# EAGLE design pccasefanctrlx8 (EAGLE 6.0)
DESIGN_REV: 1.0; DRAWING_NAME: PCBCaseFanCTRx8
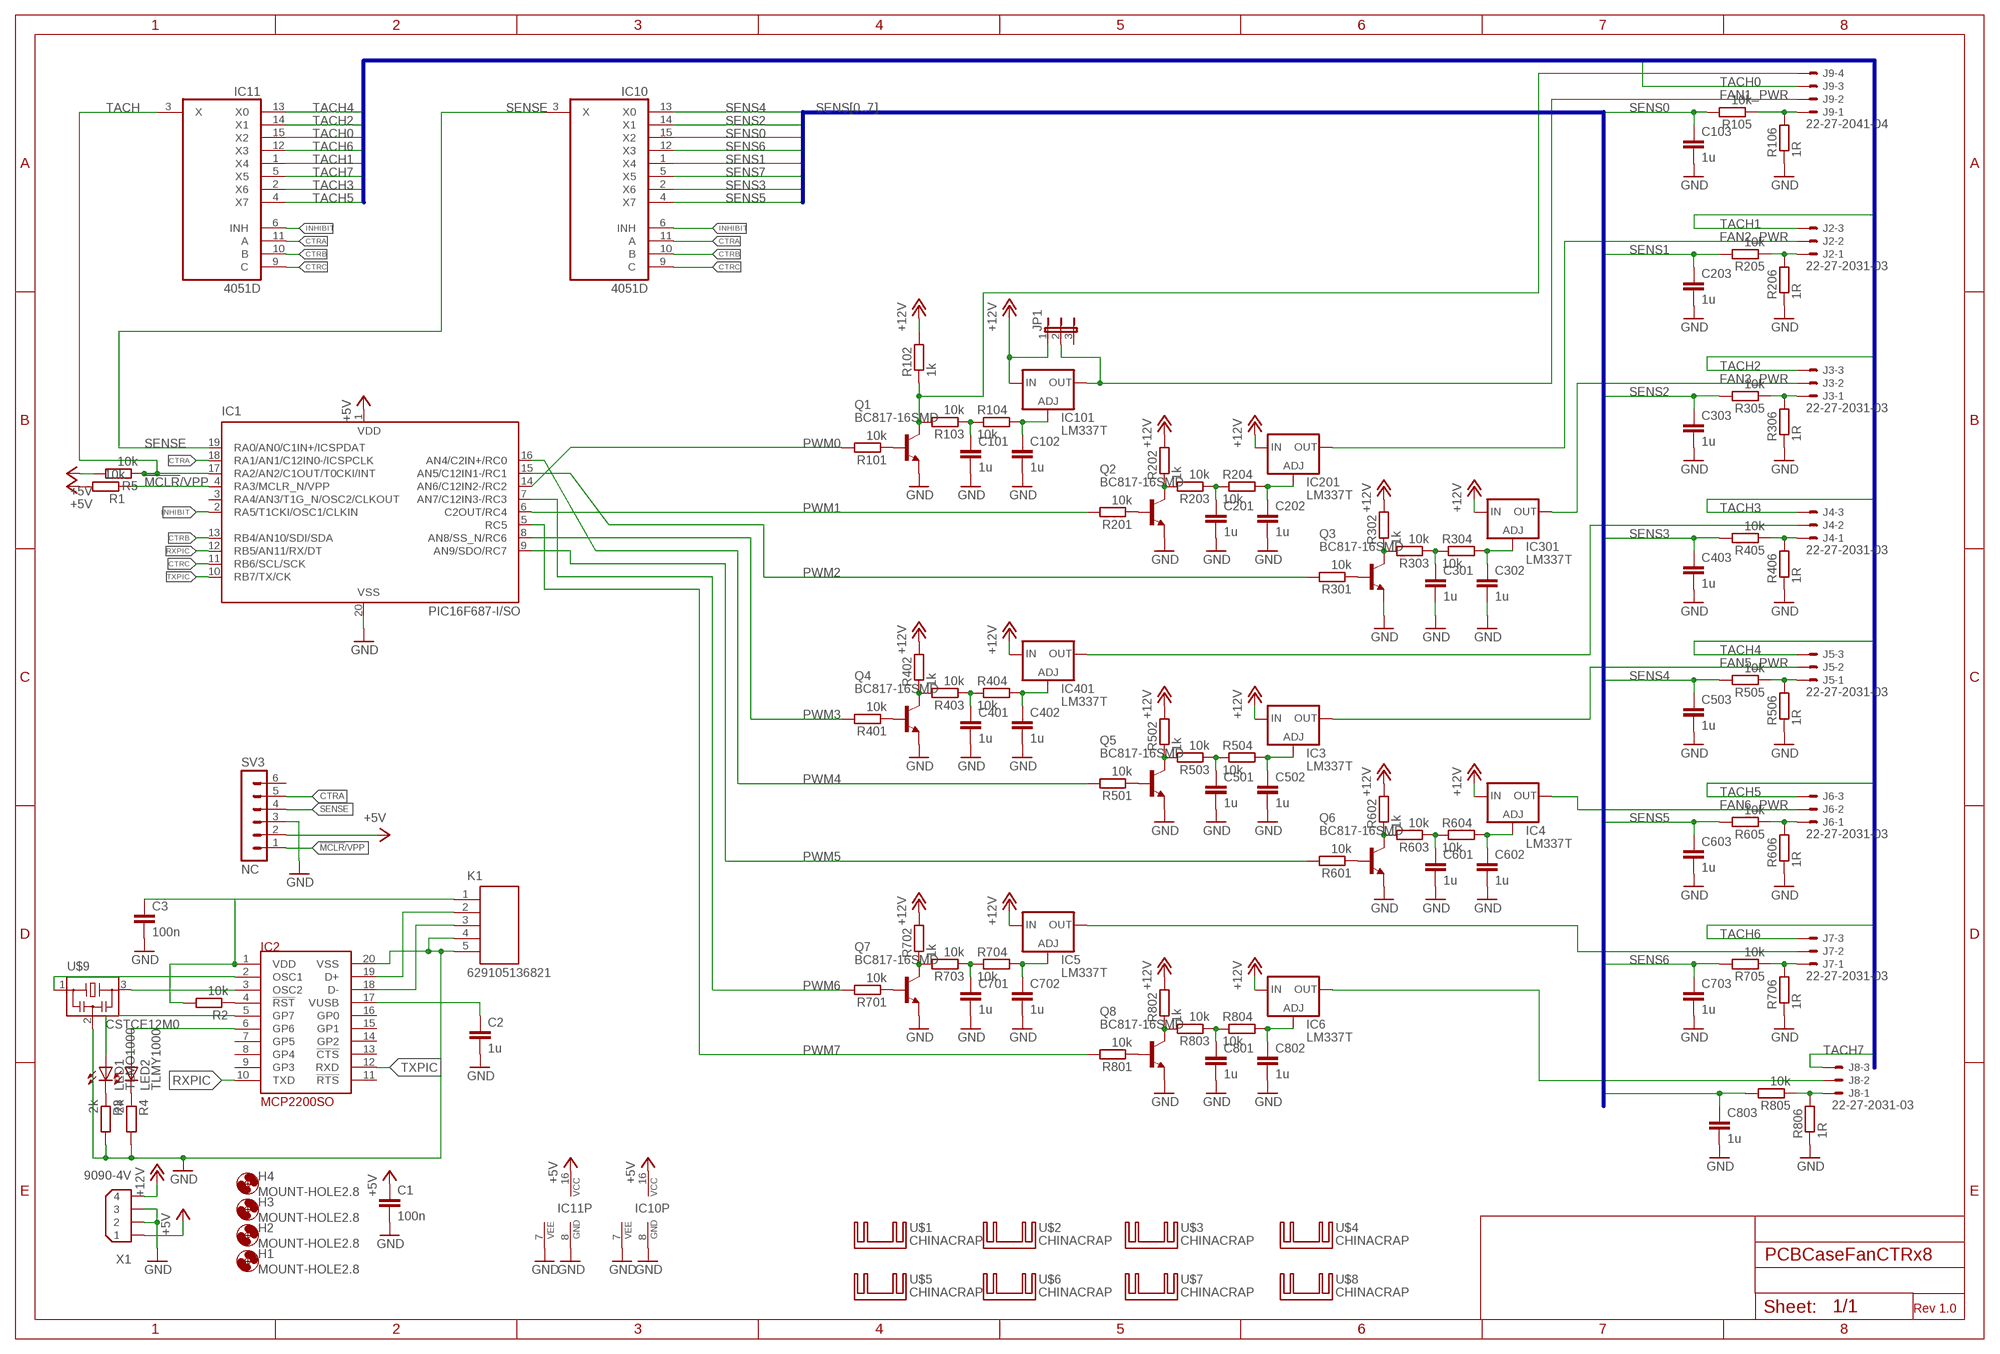
[diagram p0: schematic, sheet 1]

## Parts
C1  100n  C-EUC0603K  [C0603K]
C2  1u  C-EUC0603K  [C0603K]
C3  100n  C-EUC0603K  [C0603K]
C101  1u  C-EUC0603K  [C0603K]
C102  1u  C-EUC0603K  [C0603K]
C103  1u  C-EUC0603K  [C0603K]
C201  1u  C-EUC0603K  [C0603K]
C202  1u  C-EUC0603K  [C0603K]
C203  1u  C-EUC0603K  [C0603K]
C301  1u  C-EUC0603K  [C0603K]
C302  1u  C-EUC0603K  [C0603K]
C303  1u  C-EUC0603K  [C0603K]
C401  1u  C-EUC0603K  [C0603K]
C402  1u  C-EUC0603K  [C0603K]
C403  1u  C-EUC0603K  [C0603K]
C501  1u  C-EUC0603K  [C0603K]
C502  1u  C-EUC0603K  [C0603K]
C503  1u  C-EUC0603K  [C0603K]
C601  1u  C-EUC0603K  [C0603K]
C602  1u  C-EUC0603K  [C0603K]
C603  1u  C-EUC0603K  [C0603K]
C701  1u  C-EUC0603K  [C0603K]
C702  1u  C-EUC0603K  [C0603K]
C703  1u  C-EUC0603K  [C0603K]
C801  1u  C-EUC0603K  [C0603K]
C802  1u  C-EUC0603K  [C0603K]
C803  1u  C-EUC0603K  [C0603K]
H1  MOUNT-HOLE2.8  [2,8]
H2  MOUNT-HOLE2.8  [2,8]
H3  MOUNT-HOLE2.8  [2,8]
H4  MOUNT-HOLE2.8  [2,8]
IC1  PIC16F687-I/SO  [SO-20W]
IC2  MCP2200SO  [SO-20W]
IC3  LM337T  LM317TS  [317TS]
IC4  LM337T  LM317TS  [317TS]
IC5  LM337T  LM317TS  [317TS]
IC6  LM337T  LM317TS  [317TS]
IC10  4051D  [SO16]
IC11  4051D  [SO16]
IC101  LM337T  LM317TS  [317TS]
IC201  LM337T  LM317TS  [317TS]
IC301  LM337T  LM317TS  [317TS]
IC401  LM337T  LM317TS  [317TS]
J2  22-27-2031-03  [6410-03]
J3  22-27-2031-03  [6410-03]
J4  22-27-2031-03  [6410-03]
J5  22-27-2031-03  [6410-03]
J6  22-27-2031-03  [6410-03]
J7  22-27-2031-03  [6410-03]
J8  22-27-2031-03  [6410-03]
J9  22-27-2041-04  [6410-04]
JP1  JP2E  [JP2]
K1  629105136821  [629105136821]
LED1  TLMO1000  LEDSML0603  [SML0603]
LED2  TLMY1000  LEDSML0603  [SML0603]
Q1  BC817-16SMD  [SOT23-BEC]
Q2  BC817-16SMD  [SOT23-BEC]
Q3  BC817-16SMD  [SOT23-BEC]
Q4  BC817-16SMD  [SOT23-BEC]
Q5  BC817-16SMD  [SOT23-BEC]
Q6  BC817-16SMD  [SOT23-BEC]
Q7  BC817-16SMD  [SOT23-BEC]
Q8  BC817-16SMD  [SOT23-BEC]
R1  10k  R-EU_R0603  [R0603]
R2  10k  R-EU_R0603  [R0603]
R3  2k  R-EU_R0603  [R0603]
R4  2k  R-EU_R0603  [R0603]
R5  10k  R-EU_R0603  [R0603]
R101  10k  R-EU_R0603  [R0603]
R102  1k  R-EU_R0603  [R0603]
R103  10k  R-EU_R0603  [R0603]
R104  10k  R-EU_R0603  [R0603]
R105  10k  R-EU_R0603  [R0603]
R106  1R  R-EU_0613/5V  [P0613V]
R201  10k  R-EU_R0603  [R0603]
R202  1k  R-EU_R0603  [R0603]
R203  10k  R-EU_R0603  [R0603]
R204  10k  R-EU_R0603  [R0603]
R205  10k  R-EU_R0603  [R0603]
R206  1R  R-EU_0613/5V  [P0613V]
R301  10k  R-EU_R0603  [R0603]
R302  1k  R-EU_R0603  [R0603]
R303  10k  R-EU_R0603  [R0603]
R304  10k  R-EU_R0603  [R0603]
R305  10k  R-EU_R0603  [R0603]
R306  1R  R-EU_0613/5V  [P0613V]
R401  10k  R-EU_R0603  [R0603]
R402  1k  R-EU_R0603  [R0603]
R403  10k  R-EU_R0603  [R0603]
R404  10k  R-EU_R0603  [R0603]
R405  10k  R-EU_R0603  [R0603]
R406  1R  R-EU_0613/5V  [P0613V]
R501  10k  R-EU_R0603  [R0603]
R502  1k  R-EU_R0603  [R0603]
R503  10k  R-EU_R0603  [R0603]
R504  10k  R-EU_R0603  [R0603]
R505  10k  R-EU_R0603  [R0603]
R506  1R  R-EU_0613/5V  [P0613V]
R601  10k  R-EU_R0603  [R0603]
R602  1k  R-EU_R0603  [R0603]
R603  10k  R-EU_R0603  [R0603]
R604  10k  R-EU_R0603  [R0603]
R605  10k  R-EU_R0603  [R0603]
R606  1R  R-EU_0613/5V  [P0613V]
R701  10k  R-EU_R0603  [R0603]
R702  1k  R-EU_R0603  [R0603]
R703  10k  R-EU_R0603  [R0603]
R704  10k  R-EU_R0603  [R0603]
R705  10k  R-EU_R0603  [R0603]
R706  1R  R-EU_0613/5V  [P0613V]
R801  10k  R-EU_R0603  [R0603]
R802  1k  R-EU_R0603  [R0603]
R803  10k  R-EU_R0603  [R0603]
R804  10k  R-EU_R0603  [R0603]
R805  10k  R-EU_R0603  [R0603]
R806  1R  R-EU_0613/5V  [P0613V]
SV3  NC  MA06-1  [MA06-1]
U$1  CHINACRAP  [MYCHINACRAP]
U$2  CHINACRAP  [MYCHINACRAP]
U$3  CHINACRAP  [MYCHINACRAP]
U$4  CHINACRAP  [MYCHINACRAP]
U$5  CHINACRAP  [MYCHINACRAP]
U$6  CHINACRAP  [MYCHINACRAP]
U$7  CHINACRAP  [MYCHINACRAP]
U$8  CHINACRAP  [MYCHINACRAP]
U$9  CSTCE12M0  [CSTCE_G]
X1  9090-4V  [9090-4V]

## Nets
!MCLR!/VPP: IC1.4(RA3/MCLR_N/VPP) R1.1 SV3.1
+5V: C1.1 IC1.1(VDD) IC10.16(VCC) IC11.16(VCC) R1.2 R5.2 SV3.2 X1.1
+12V: IC3.3(IN) IC4.3(IN) IC5.3(IN) IC6.3(IN) IC101.3(IN) IC201.3(IN) IC301.3(IN) IC401.3(IN) JP1.1 R102.2 R202.2 R302.2 R402.2 R502.2 R602.2 R702.2 R802.2 X1.4
CTRA: IC1.18(RA1/AN1/C12IN0-/ICSPCLK) IC10.11(A) IC11.11(A) SV3.5
CTRB: IC1.13(RB4/AN10/SDI/SDA) IC10.10(B) IC11.10(B)
CTRC: IC1.11(RB6/SCL/SCK) IC10.9(C) IC11.9(C)
FAN1_PWR: IC101.2(OUT) J9.2 JP1.2
FAN2_PWR: IC201.2(OUT) J2.2
FAN3_PWR: IC301.2(OUT) J3.2
FAN5_PWR: IC3.2(OUT) J5.2
FAN6_PWR: IC4.2(OUT) J6.2
GND: C1.2 C2.2 C3.2 C101.2 C102.2 C103.2 C201.2 C202.2 C203.2 C301.2 C302.2 C303.2 C401.2 C402.2 C403.2 C501.2 C502.2 C503.2 C601.2 C602.2 C603.2 C701.2 C702.2 C703.2 C801.2 C802.2 C803.2 IC1.20(VSS) IC2.20(VSS) IC10.7(VEE) IC10.8(GND) IC11.7(VEE) IC11.8(GND) K1.4 K1.5 Q1.E Q2.E Q3.E Q4.E Q5.E Q6.E Q7.E Q8.E R3.2 R4.2 R106.1 R206.1 R306.1 R406.1 R506.1 R606.1 R706.1 R806.1 SV3.3 U$9.2 X1.2 X1.3
INHIBIT: IC1.2(RA5/T1CKI/OSC1/CLKIN) IC10.6(INH) IC11.6(INH)
N$1: J9.4 Q1.C R102.1 R103.2
N$2: Q1.B R101.1
N$3: C201.1 R203.1 R204.1
N$4: C101.1 R103.1 R104.1
N$5: C102.1 IC101.1(ADJ) R104.2
N$6: C202.1 IC201.1(ADJ) R204.2
N$7: Q2.C R202.1 R203.2
N$8: Q2.B R201.1
N$9: J9.1 R105.1 R106.2
N$10: J4.1 R405.1 R406.2
N$11: C301.1 R303.1 R304.1
N$12: C302.1 IC301.1(ADJ) R304.2
N$13: Q3.C R302.1 R303.2
N$14: Q3.B R301.1
N$15: C401.1 R403.1 R404.1
N$16: C402.1 IC401.1(ADJ) R404.2
N$17: Q4.C R402.1 R403.2
N$18: Q4.B R401.1
N$19: IC401.2(OUT) J4.2
N$20: J2.1 R205.1 R206.2
N$21: IC2.2(OSC1) U$9.1
N$22: IC2.3(OSC2) U$9.3
N$23: C3.1 IC2.1(VDD) K1.1 R2.2
N$25: IC2.4(!RST!) R2.1
N$26: IC2.18(D-) K1.3
N$27: IC2.19(D+) K1.2
N$28: IC2.5(GP7) LED1.A
N$29: C2.1 IC2.17(VUSB)
N$30: IC2.6(GP6) LED2.A
N$31: LED1.C R3.1
N$32: LED2.C R4.1
N$33: C501.1 R503.1 R504.1
N$34: C502.1 IC3.1(ADJ) R504.2
N$35: Q5.C R502.1 R503.2
N$36: Q5.B R501.1
N$37: C601.1 R603.1 R604.1
N$38: C602.1 IC4.1(ADJ) R604.2
N$39: Q6.C R602.1 R603.2
N$40: Q6.B R601.1
N$41: IC5.2(OUT) J7.2
N$42: C701.1 R703.1 R704.1
N$43: C702.1 IC5.1(ADJ) R704.2
N$44: Q7.C R702.1 R703.2
N$45: Q7.B R701.1
N$46: C801.1 R803.1 R804.1
N$47: C802.1 IC6.1(ADJ) R804.2
N$48: Q8.C R802.1 R803.2
N$49: Q8.B R801.1
N$50: IC6.2(OUT) J8.2
N$51: J3.1 R305.1 R306.2
N$52: J6.1 R605.1 R606.2
N$53: J7.1 R705.1 R706.2
N$54: J8.1 R805.1 R806.2
N$55: J5.1 R505.1 R506.2
PWM0: IC1.14(AN6/C12IN2-/RC2) R101.2
PWM1: IC1.6(C2OUT/RC4) R201.2
PWM2: IC1.15(AN5/C12IN1-/RC1) R301.2
PWM3: IC1.8(AN8/SS_N/RC6) R401.2
PWM4: IC1.16(AN4/C2IN+/RC0) R501.2
PWM5: IC1.9(AN9/SDO/RC7) R601.2
PWM6: IC1.7(AN7/C12IN3-/RC3) R701.2
PWM7: IC1.5(RC5) R801.2
RXPIC: IC1.12(RB5/AN11/RX/DT) IC2.10(TXD)
SENS0: C103.1 IC10.15(X2) R105.2
SENS1: C203.1 IC10.1(X4) R205.2
SENS2: C303.1 IC10.14(X1) R305.2
SENS3: C403.1 IC10.2(X6) R405.2
SENS4: C503.1 IC10.13(X0) R505.2
SENS5: C603.1 IC10.4(X7) R605.2
SENS6: C703.1 IC10.12(X3) R705.2
SENS7: C803.1 IC10.5(X5) R805.2
SENSE: IC1.19(RA0/AN0/C1IN+/ICSPDAT) IC10.3(X) SV3.4
TACH: IC1.17(RA2/AN2/C1OUT/T0CKI/INT) IC11.3(X) R5.1
TACH0: IC11.15(X2) J9.3
TACH1: IC11.1(X4) J2.3
TACH2: IC11.14(X1) J3.3
TACH3: IC11.2(X6) J4.3
TACH4: IC11.13(X0) J5.3
TACH5: IC11.4(X7) J6.3
TACH6: IC11.12(X3) J7.3
TACH7: IC11.5(X5) J8.3
TXPIC: IC1.10(RB7/TX/CK) IC2.12(RXD)
Unconnected: IC1.3(RA4/AN3/T1G_N/OSC2/CLKOUT) IC2.7(GP5) IC2.8(GP4) IC2.9(GP3) IC2.11(!RTS!) IC2.13(!CTS!) IC2.14(GP2) IC2.15(GP1) IC2.16(GP0) JP1.3 SV3.6

## Buses
TACH[0..7]
SENS[0..7]

## Notes on the sheet
- Rev

## Library data of the parts
C1-C3 C101-C103 C201-C203 C301-C303 C401-C403 C501-C503 C601-C603 C701-C703 C801-C803 = rcl:C-EU: CAPACITOR, European symbol
H1-H4 = holes:MOUNT-HOLE: MOUNTING HOLE with drill center marker
IC1 = microchip:PIC16F687
IC2 = microchip:MCP2200
IC3-IC6 IC101 IC201 IC301 IC401 = v-reg:LM317TS: VOLTAGE REGULATOR
IC10 IC11 = 40xx:4051: 8-channel ANALOG MULTIPLEXER
J2-J8 = con-molex:22-?-03: CONNECTOR wire to board 2.54 mm (.1 inch) pitch header; OC_FARNELL: unknown; OC_NEWARK: unknown
J9 = con-molex:22-?-04: CONNECTOR wire to board 2.54 mm (.1 inch) pitch header; OC_FARNELL: unknown; OC_NEWARK: unknown
JP1 = jumper:JP2E: JUMPER
K1 = USBSteckverbinderWR-COM:629105136821: WR-COM SMT Horizontal 5 Contacts Micro USB Type B,5 pins=>Code : Con_I-O_COM_MicroUSB_629105136821 <http://katalog.we-online.de/media/images/eican/Con_I-O_COM_MicroUSB_629105136821_pf2.jpg> Details see: http://katalog.we-online.de/en/em/629_105_136_821 Created 2014-07-09, Karrer Zheng 2014 (C) Würth Elektronik
LED1 LED2 = led:LED: LED OSRAM: - CHIPLED LG R971, LG N971, LY N971, LG Q971, LY Q971, LO R971, LY R971 LH N974, LH R974 LS Q976, LO Q976, LY Q976 LO Q996 - Hyper CHIPLED LW Q18S LB Q993, LB Q99A, LB R99A - SideLED LS A670, LO A670, LY A670, LG A670, LP A670 LB A673, LV A673, LT A673, LW A673 LH A674 LY A675 LS A676, LA A676, LO A676, LY A676, LW A676 LS A679, LY A679, LG A679 - Hyper Micro SIDELED® LS Y876, LA Y876, LO Y876, LY Y876 LT Y87S - SmartLED LW L88C, LW L88S LB L89C, LB L89S, LG L890 LS L89K, LO L89K, LY L89K LS L896, LA L896, LO L896, LY L896 - TOPLED LS T670, LO T670, LY T670, LG T670, LP T670 LSG T670, LSP T670, LSY T670, LOP T670, LYG T670 LG T671, LOG T671, LSG T671 LB T673, LV T673, LT T673, LW T673 LH T674 LS T676, LA T676, LO T676, LY T676, LB T676, LH T676, LSB T676, LW T676 LB T67C, LV T67C, LT T67C, LS T67K, LO T67K, LY T67K, LW E67C LS E67B, LA E67B, LO E67B, LY E67B, LB E67C, LV E67C, LT E67C LW T67C LS T679, LY T679, LG T679 LS T770, LO T770, LY T770, LG T770, LP T770 LB T773, LV T773, LT T773, LW T773 LH T774 LS E675, LA E675, LY E675, LS T675 LS T776, LA T776, LO T776, LY T776, LB T776 LHGB T686 LT T68C, LB T68C - Hyper Mini TOPLED® LB M676 - Mini TOPLED Santana® LG M470 LS M47K, LO M47K, LY M47K Source: http://www.osram.convergy.de LUXEON: - LUMILED® LXK2-PW12-R00, LXK2-PW12-S00, LXK2-PW14-U00, LXK2-PW14-V00 LXK2-PM12-R00, LXK2-PM12-S00, LXK2-PM14-U00 LXK2-PE12-Q00, LXK2-PE12-R00, LXK2-PE12-S00, LXK2-PE14-T00, LXK2-PE14-U00 LXK2-PB12-K00, LXK2-PB12-L00, LXK2-PB12-M00, LXK2-PB14-N00, LXK2-PB14-P00, LXK2-PB14-Q00 LXK2-PR12-L00, LXK2-PR12-M00, LXK2-PR14-Q00, LXK2-PR14-R00 LXK2-PD12-Q00, LXK2-PD12-R00, LXK2-PD12-S00 LXK2-PH12-R00, LXK2-PH12-S00 LXK2-PL12-P00, LXK2-PL12-Q00, LXK2-PL12-R00 Source: www.luxeon.com KINGBRIGHT: KA-3528ASYC Source: www.kingbright.com
Q1-Q8 = transistor-npn:BC817*: NPN Transistor
R1-R5 R101-R106 R201-R206 R301-R306 R401-R406 R501-R506 R601-R606 R701-R706 R801-R806 = resistor:R-EU_: RESISTOR, European symbol
SV3 = con-lstb:MA06-1: PIN HEADER; OC_FARNELL: unknown; OC_NEWARK: unknown
U$1-U$8 = heatsink:CHINACRAP
U$9 = murata-filter:CSTCE12M0
X1 = con-thomas-betts:9090-4: Disk Drive Power four position Source: Thomas & Betts Electronic Interconnects Eiropean Edition 1998; OC_FARNELL: unknown; OC_NEWARK: unknown

## Board
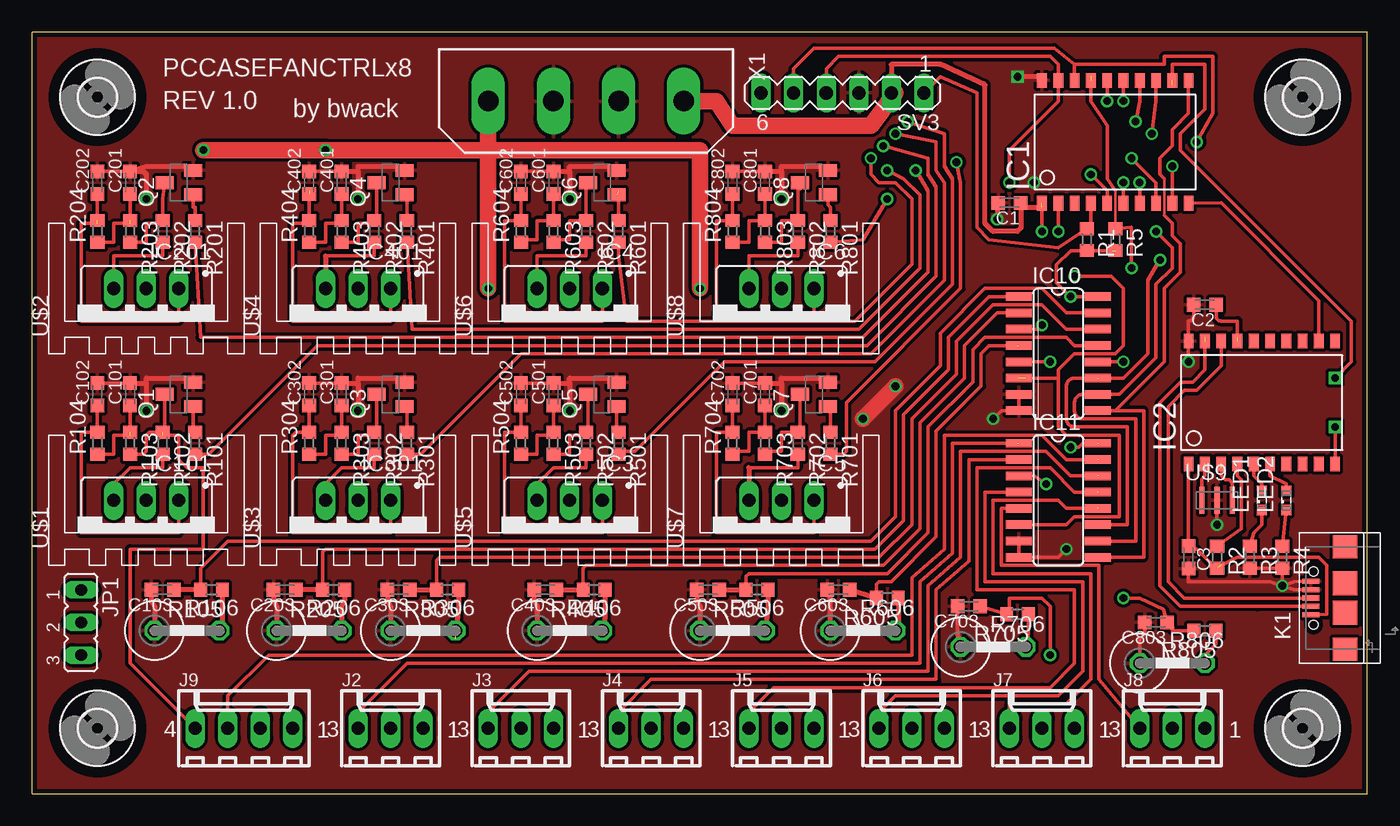
[diagram p1: board, top side]
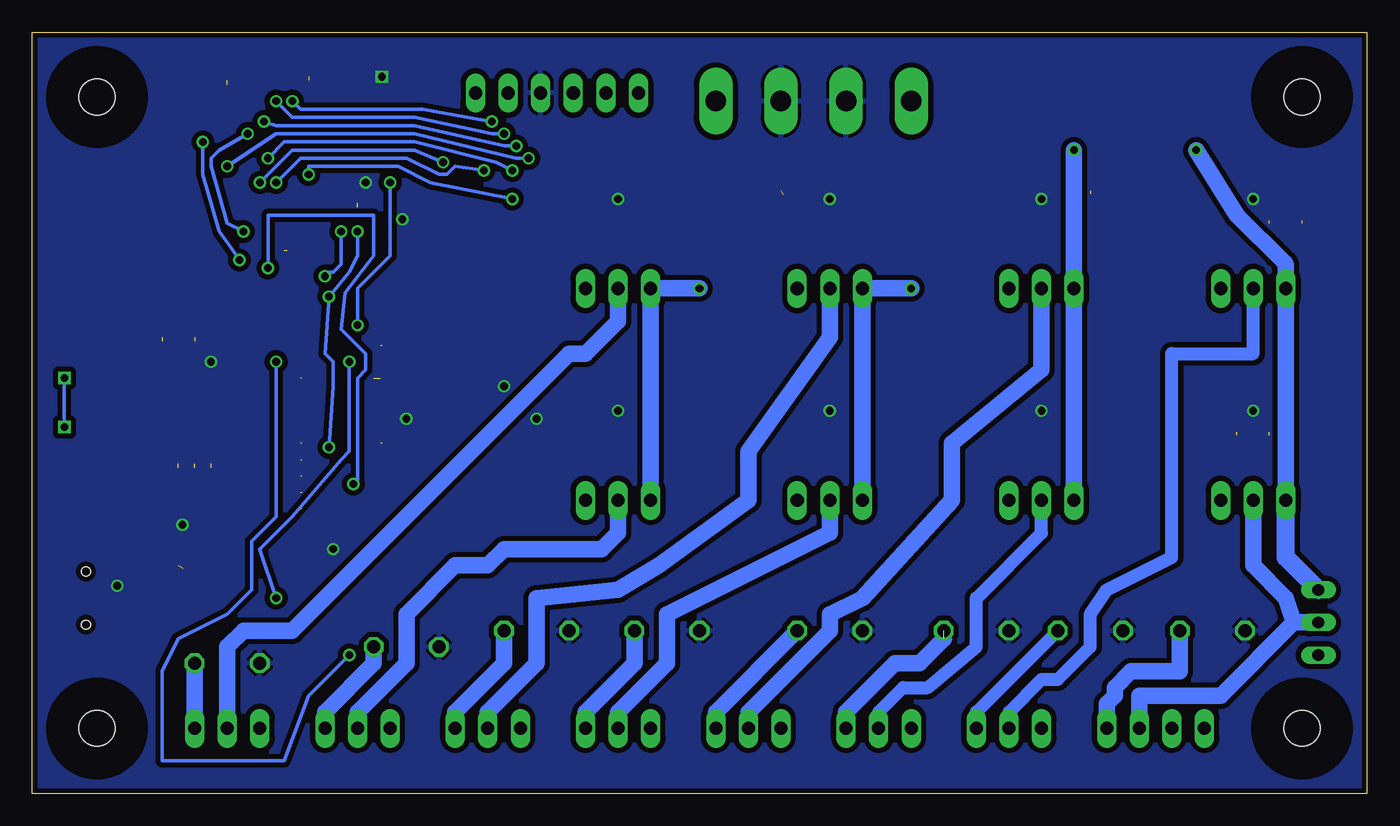
[diagram p2: board, bottom side, seen from below]

Size 104.14 x 59.36 mm. Coordinates in mm from the lower left corner, seen from the top.
Outline: 0.02,0 104.14,0 104.14,59.36 0.02,59.36
Outline: 0,0 0,59.36
Copper layers (1*16): Top 0.0356mm / dielectric 1.5011mm / Bottom 0.0356mm
Design rules: minimum track width 6mil, minimum drill 13mil, track to track 6mil, track to pad 6mil, pad to pad 6mil, via to via 6mil, smd to smd 6mil, copper to edge 15mil, drill to drill 6mil, minimum pad ring 7mil, minimum via ring 7mil, stop-mask expansion 3mil, vias tented up to drill 0mil, thermal gap 10mil

### Footprints (pad centres in the part's own frame; a part is rotated, then mirrored left to right if it is on the bottom)
C0603K = smd 1.05 x 1.08: 1 -0.875,0; 2 0.875,0
2,8 = hole 2.8: 0,0
SO-20W = smd 0.762 x 1.143: 1 -3.81,-4.788; 2 -2.54,-4.788; 3 -1.27,-4.788; 4 0,-4.788; 5 1.27,-4.788; 6 2.54,-4.788; 7 3.81,-4.788; 8 5.08,-4.788; 9 6.35,-4.788; 10 7.62,-4.788; 11 7.62,4.788; 12 6.35,4.788; 13 5.08,4.788; 14 3.81,4.788; 15 2.54,4.788; 16 1.27,4.788; 17 0,4.788; 18 -1.27,4.788; 19 -2.54,4.788; 20 -3.81,4.788
317TS = drill 1.016 long: 1 -2.54,-2.54; 2 0,-2.54; 3 2.54,-2.54
SO16 = smd 0.66 x 2.032: 1 -4.445,-3.073; 2 -3.175,-3.073; 3 -1.905,-3.073; 4 -0.635,-3.073; 5 0.635,-3.073; 6 1.905,-3.073; 7 3.175,-3.073; 8 4.445,-3.073; 9 4.445,3.073; 10 3.175,3.073; 11 1.905,3.073; 12 0.635,3.073; 13 -0.635,3.073; 14 -1.905,3.073; 15 -3.175,3.073; 16 -4.445,3.073
6410-03 = drill 1.016 long: 1 2.54,0; 2 0,0; 3 -2.54,0
6410-04 = drill 1.016 long: 1 3.81,0; 2 1.27,0; 3 -1.27,0; 4 -3.81,0
JP2 = drill 0.914 long: 1 -2.54,0; 2 0,0; 3 2.54,0
629105136821 = smd 0.4 x 1.35: 1 -1.3,0; 2 -0.65,0; 3 0,0; 4 0.65,0; 5 1.3,0 | smd 1.8 x 1.9: Z1 -4,-2.675; Z4 4,-2.675 | smd 1.9 x 1.9: Z2 -1.15,-2.675; Z3 1.15,-2.675 | hole 0.7: -2.075,-0.225; 2.075,-0.225
SML0603 = smd 0.8 x 0.8: A 0.75,0; C -0.75,0
SOT23-BEC = smd 1 x 1.4: B -0.95,-1.1; C 0,1.1; E 0.95,-1.1
R0603 = smd 1 x 1.1: 1 -0.85,0; 2 0.85,0
P0613V = drill 1.016 octagon: 1 -2.54,0; 2 2.54,0
MA06-1 = drill 1.016 long: 1 -6.35,0; 2 -3.81,0; 3 -1.27,0; 4 1.27,0; 5 3.81,0; 6 6.35,0
CSTCE_G = smd 0.4 x 2.1: 1 -1.2,0; 2 0,0; 3 1.2,0
9090-4V = drill 1.6 pad 2.6 long: 1 -7.62,0; 2 -2.54,0; 3 2.54,0; 4 7.62,0

### Placement (x,y rotation side)
C1  76.22,46.04 180 top
C2  91.46,38.1 180 top
C3  90.19,18.41 270 top
C101  7.64,31.11 90 top
C102  5.1,31.11 90 top
C103  10.18,15.88 180 top
C201  7.64,47.62 90 top
C202  5.1,47.62 90 top
C203  19.7,15.88 180 top
C301  24.15,31.11 90 top
C302  21.61,31.11 90 top
C303  28.59,15.88 180 top
C401  24.15,47.62 90 top
C402  21.61,47.62 90 top
C403  40.03,15.88 180 top
C501  40.66,31.11 90 top
C502  38.12,31.11 90 top
C503  52.73,15.88 180 top
C601  40.66,47.62 90 top
C602  38.12,47.62 90 top
C603  62.89,15.88 180 top
C701  57.17,31.11 90 top
C702  54.63,31.11 90 top
C703  73.05,14.61 180 top
C801  57.17,47.62 90 top
C802  54.63,47.62 90 top
C803  87.65,13.34 180 top
H1  5.1,5.08 0 top
H2  99.08,5.08 0 top
H3  99.08,54.29 0 top
H4  5.1,54.29 0 top
IC1  82.57,50.8 0 top
IC2  94,30.48 0 top
IC3  41.93,20.32 180 top
IC4  41.93,36.83 180 top
IC5  58.44,20.32 180 top
IC6  58.44,36.83 180 top
IC10  80.03,34.29 270 top
IC11  80.03,22.86 270 top
IC101  8.91,20.32 180 top
IC201  8.91,36.83 180 top
IC301  25.42,20.32 180 top
IC401  25.42,36.83 180 top
J2  27.96,5.08 0 top
J3  38.12,5.08 0 top
J4  48.28,5.08 0 top
J5  58.44,5.08 0 top
J6  68.6,5.08 0 top
J7  78.76,5.08 0 top
J8  88.92,5.08 0 top
J9  16.53,5.08 0 top
JP1  3.83,13.34 270 top
K1  99.71,15.24 90 top
LED1  95.91,22.86 90 top
LED2  97.81,22.86 90 top
Q1  11.45,31.11 90 top
Q2  11.45,47.62 90 top
Q3  27.96,31.11 90 top
Q4  27.96,47.62 90 top
Q5  44.47,31.11 90 top
Q6  44.47,47.62 90 top
Q7  60.98,31.11 90 top
Q8  60.98,47.62 90 top
R1  82.25,43.18 270 top
R2  92.41,18.41 270 top
R3  94.95,18.41 270 top
R4  97.49,18.41 270 top
R5  84.47,43.18 270 top
R101  12.72,27.3 270 top
R102  10.18,27.3 270 top
R103  7.64,27.3 270 top
R104  5.1,27.3 90 top
R105  13.99,15.88 180 top
R106  12.08,12.7 0 top
R201  12.72,43.81 270 top
R202  10.18,43.81 270 top
R203  7.64,43.81 270 top
R204  5.1,43.81 90 top
R205  23.52,15.88 180 top
R206  21.61,12.7 0 top
R301  29.23,27.3 270 top
R302  26.69,27.3 270 top
R303  24.15,27.3 270 top
R304  21.61,27.3 90 top
R305  32.41,15.88 180 top
R306  30.5,12.7 0 top
R401  29.23,43.81 270 top
R402  26.69,43.81 270 top
R403  24.15,43.81 270 top
R404  21.61,43.81 90 top
R405  43.84,15.88 180 top
R406  41.93,12.7 0 top
R501  45.74,27.3 270 top
R502  43.2,27.3 270 top
R503  40.66,27.3 270 top
R504  38.12,27.3 90 top
R505  56.54,15.88 180 top
R506  54.63,12.7 0 top
R601  45.74,43.81 270 top
R602  43.2,43.81 270 top
R603  40.66,43.81 270 top
R604  38.12,43.81 90 top
R605  66.69,15.24 180 top
R606  64.79,12.7 0 top
R701  62.25,27.3 270 top
R702  59.71,27.3 270 top
R703  57.17,27.3 270 top
R704  54.63,27.3 90 top
R705  76.85,13.97 180 top
R706  74.95,11.43 0 top
R801  62.25,43.81 270 top
R802  59.71,43.81 270 top
R803  57.17,43.81 270 top
R804  54.63,43.81 90 top
R805  91.46,12.7 180 top
R806  88.92,10.16 0 top
SV3  63.2,54.61 180 top
U$1  8.91,20.32 0 top
U$2  8.91,36.83 0 top
U$3  25.42,20.32 0 top
U$4  25.42,36.83 0 top
U$5  41.93,20.32 0 top
U$6  41.93,36.83 0 top
U$7  58.44,20.32 0 top
U$8  58.44,36.83 0 top
U$9  92.41,22.86 0 top
X1  43.2,53.98 180 top

### Tracks (layer width: path | path; a pad name or v marks a point on that pad's centre or on a via)
!MCLR!/VPP
  Top 0.254: R1.1 82.57,44.45 | IC1.4 82.57,44.45 | 82.57,44.45 81.94,43.81 80.03,42.55 74.63,43.18 73.68,44.13 73.68,54.61 70.82,55.88 SV3.1
+5V  (via drill 0.6)  (3 unrouted)
  Top 0.254: IC10.16 v80.98,38.73 79.9,39.82 79.9,41.22 81.01,42.33 R1.2 84.26,42.33 84.47,42.55 | v78.76,43.81 IC1.1 | v80.98,26.99 81.62,26.99 81.94,27.3 83.2,27.3
  Top 0.406: 78.76,45.72 77.23,45.72 arc-45 77,45.81 C1.1 77.09,44.05 76.85,43.81 74.95,43.81 74.31,44.45 74.31,55.24 70.82,56.83 67.01,56.83 SV3.2
  Top 1.27: SV3.2 67.33,54.61 65.42,52.07 54.63,52.07 53.36,53.98 X1.1
  Bottom 0.254: v78.76,43.81 78.76,41.91 79.39,40.64 v80.98,38.73 81.3,34.29 80.66,33.66 80.66,31.75 v80.98,26.99
+12V  (via drill 0.6)
  Top 0.254: R202.2 10.18,41.91 6.37,41.91 IC201.3 | R102.2 10.18,25.4 7.64,25.4 6.37,24.13 IC101.3 | R302.2 26.69,25.4 24.15,25.4 22.88,24.13 IC301.3 | R402.2 26.69,41.91 22.88,41.91 | R502.2 43.2,25.4 40.66,25.4 39.39,24.13 IC3.3 | R602.2 43.2,41.91 39.39,41.91 IC4.3 | R702.2 59.71,25.4 55.9,25.4 | R802.2 59.71,41.91 55.9,41.91 IC6.3
  Top 0.406: 22.88,41.91 IC401.3 | 55.9,25.4 IC5.3
  Top 1.27: X1.4 35.58,50.16 | v52.09,39.37 52.09,50.16 35.58,50.16 | 35.58,50.16 v22.88,50.16 v13.36,50.16 | 35.58,50.16 v35.58,39.37
  Bottom 1.27: v35.58,39.37 IC4.3 IC3.3 | v13.36,50.16 10.18,45.09 6.46,41.37 arc45 6.37,41.14 IC201.3 IC101.3 | IC5.3 IC6.3 v52.09,39.37 | IC301.3 IC401.3 v22.88,50.16
  Bottom 1.422: JP1.1 6.37,18.41 IC101.3
CTRA  (via drill 0.6)  (1 unrouted)
  Top 0.254: IC11.11 85.43,20.95 85.43,28.57 81.3,28.57 arc-90 80.66,29.21 80.66,31.75 arc-90 81.3,32.38 IC10.11 | IC1.18 81.3,56.83 | v87.97,41.59 87.02,40.01 87.02,34.29 85.11,32.38 83.2,32.38 | SV3.5 59.39,56.52 60.98,58.1 79.71,58.1 81.3,56.83 | v90.83,50.8 92.09,53.02 92.09,57.47 88.28,57.47 88.28,56.83 81.3,56.83
  Bottom 0.254: v87.97,41.59 89.55,43.81 90.83,48.26 v90.83,50.8
CTRB  (via drill 0.6)
  Top 0.254: IC11.10 86.06,19.68 86.06,29.21 81.94,29.21 arc-90 81.3,29.84 81.3,30.48 arc-90 81.94,31.11 IC10.10 84.79,31.11 87.65,33.97 87.65,39.69 88.92,40.96 88.92,42.55 v87.65,43.81 | v87.33,51.44 87.65,53.98 IC1.13
  Bottom 0.254: v87.65,43.81 88.92,44.45 90.19,48.9 90.19,49.53 89.55,50.16 v87.33,51.44
CTRC
  Top 0.203: 88.28,45.09 88.28,47.94
  Top 0.254: IC11.9 86.7,18.41 86.7,29.84 84.47,29.84 | IC10.9 84.47,29.84 | 84.47,29.84 88.28,33.66 88.28,39.37 89.55,40.64 89.55,42.86 88.92,43.5 88.92,44.45 88.28,45.09 | 88.28,47.94 87.97,48.26 87.97,49.53 88.92,50.48 88.92,51.75 90.19,53.02 IC1.11
FAN1_PWR
  Bottom 1.27: J9.2 17.8,7.62 11.45,7.62 5.73,13.34 | 5.73,13.34 JP1.2 | 5.73,13.34 6.37,15.24 8.91,17.78 IC101.2
FAN2_PWR
  Bottom 1.016: J2.2 27.96,6.35 25.42,8.89 24.15,8.89 21.61,11.43 21.61,13.97 20.34,15.88 15.26,18.41 15.26,34.29 8.91,34.29 IC201.2
FAN3_PWR
  Bottom 1.016: J3.2 38.12,6.35 36.22,8.26 34.31,8.26 30.5,11.43 30.5,15.24 25.42,20.32 IC301.2
FAN5_PWR
  Bottom 1.27: J5.2 58.44,6.35 54.63,10.16 54.63,13.97 41.93,20.32 IC3.2
FAN6_PWR
  Bottom 1.27: J6.2 68.6,6.35 64.79,10.16 64.79,15.24 58.44,15.88 55.27,17.78 48.28,22.86 48.28,26.67 41.93,35.56 IC4.2
GND  (via drill 0.6)
  Top 0.254: C202.2 C201.2 | C102.2 C101.2 | C302.2 C301.2 | C402.2 C401.2 | C502.2 C501.2 | C602.2 C601.2 | C702.2 C701.2 | C802.2 C801.2 | C703.2 72.17,12.46 | R806.1 86.38,12.06 86.77,12.46 C803.2 | C2.2 90.58,37.23 arc-90 90.19,36.83 IC2.20 v90.19,33.66 | v80.66,19.05 80.03,18.41 IC11.8 IC11.7 | v74.95,29.21 75.58,29.84 IC10.8 IC10.7 | K1.5 98.44,16.51 v97.49,16.19 | v97.49,16.19 R4.2 R3.2 | U$9.2 v92.41,20.95 | C3.2 90.19,16.51 96.54,16.51 v97.49,16.19 | K1.4 98.44,15.88 v97.49,16.19
  Top 0.406: C101.2 8.91,31.99 | 8.91,31.99 8.91,32.38 12.55,32.38 Q1.E | C301.2 25.42,31.99 | 25.42,31.99 25.42,32.38 29.06,32.38 Q3.E | C401.2 25.42,48.5 | 25.42,48.5 25.42,48.9 29.06,48.9 Q4.E | C501.2 41.93,31.99 | 41.93,31.99 41.93,32.38 45.11,32.38 45.57,31.99 Q5.E | C601.2 41.93,48.5 | 41.93,48.5 41.93,48.9 45.57,48.9 Q6.E | C701.2 58.44,31.99 | 58.44,31.99 58.44,32.38 62.08,32.38 Q7.E | C801.2 58.44,48.5 | 58.44,48.5 58.44,48.9 61.62,48.9 62.08,48.5 Q8.E | 25.42,48.5 v25.42,46.35 | 8.91,46.04 8.91,48.26 8.67,48.5 C201.2 8.91,48.9 12.08,48.9 Q2.E 12.62,48.5 | 41.93,48.5 v41.93,46.35 | 58.44,48.5 v58.44,46.35 | 8.91,31.99 v8.91,29.84 | 25.42,31.99 v25.42,29.84 | 41.93,31.99 v41.93,29.84 | 58.44,31.99 v58.44,29.84 | C103.2 9.3,15 9.54,14.61 R106.1 | C203.2 18.83,15 19.07,14.61 R206.1 | C303.2 27.72,15 27.96,14.61 R306.1 | C403.2 39.15,15 39.39,14.61 R406.1 | C503.2 51.85,15 52.09,14.61 R506.1 | 72.17,12.46 R706.1 | R606.1 62.25,15.88 | C1.2 75.27,45.96 v75.27,44.77 | IC1.20 78.47,55.88 v76.85,55.88
  Top 1.27: v64.79,29.21 v67.33,31.75
  other vias: 8.91,46.35 78.12,47.62
  pour Bottom (isolate 0.406): 0.02,59.69 104.16,59.69 104.16,0 0.02,0
  pour Top (isolate 0.254): 0.66,59.05 104.16,59.05 104.16,0 0.02,0 0.02,59.05
INHIBIT  (via drill 0.6)  (1 unrouted)
  Top 0.254: IC11.6 80.66,20.95 81.3,21.59 84.79,21.59 84.79,27.94 80.66,27.94 80.03,28.57 80.03,32.38 | 80.03,32.38 77.49,32.38 | 80.03,32.38 80.03,33.02 81.3,34.29 84.47,34.29 85.11,34.92 85.11,39.37 84.16,40.32 v81.3,40.32 | v80.03,43.81 IC1.2
  Bottom 0.254: v81.3,40.32 81.3,40.64 80.66,40.64 80.03,41.27 v80.03,43.81
N$1  (1 unrouted)
  Top 0.254: 10.35,28.16 Q1.C | J9.4 7.64,10.16 7.64,19.05 13.36,19.05 13.36,25.4 12.08,25.4 11.45,26.04 11.45,27.94 10.18,27.94 | R103.2 8.7,26.45 8.91,26.67 8.91,27.94 9.12,28.16 R102.1
  Top 0.406: R102.1 10.35,28.16
N$2
  Top 0.254: 12.55,28.16 Q1.B
  Top 0.406: R101.1 12.55,28.16
N$3  (1 unrouted)
  Top 0.254: R204.1 6.37,42.97 6.37,44.45 7.64,44.45 | C201.1 R203.1
N$4  (1 unrouted)
  Top 0.254: R104.1 6.37,26.45 6.37,27.94 7.64,27.94 | C101.1 R103.1
N$5
  Top 0.254: C102.1 R104.2 3.83,28.16 3.83,20.32 11.45,20.32 IC101.1
N$6  (1 unrouted)
  Top 0.254: R204.2 C202.1 | IC201.1 11.45,36.83 3.83,36.83 3.83,44.45 5.1,44.45
N$7
  Top 0.254: R203.2 8.91,42.97 8.91,44.45 10.18,44.45 | R202.1 10.18,46.35 Q2.C
  Top 0.406: 10.18,44.45 R202.1
N$8
  Top 0.254: R201.1 12.72,45.72 12.55,45.72 Q2.B
N$9
  Top 0.406: R105.1 14.84,12.48 R106.2
  Bottom 1.27: J9.1 20.34,6.99 19.7,7.62 19.7,8.26 18.43,9.53 14.62,9.53 R106.2
N$10
  Top 0.406: R405.1 44.69,13.76 R406.2
  Bottom 1.27: J4.1 50.82,6.35 R406.2
N$11
  Top 0.254: R304.1 22.88,26.45 22.88,27.94 24.15,27.94 | R303.1 C301.1
  Top 0.406: 24.15,27.94 R303.1
N$12
  Top 0.254: C302.1 R304.2 20.55,28.16 20.34,27.94 20.34,20.32 27.96,20.32 IC301.1
N$13
  Top 0.254: R303.2 25.42,26.45 25.42,27.94 26.69,27.94 | 26.86,28.16 Q3.C
  Top 0.406: 26.69,27.94 R302.1 26.86,28.16
N$14
  Top 0.254: 29.23,30.16 R301.1
  Top 0.406: Q3.B 29.23,30.16
N$15
  Top 0.254: R404.1 22.88,42.97 22.88,44.45 24.15,44.45 | R403.1 C401.1
  Top 0.406: 24.15,44.45 R403.1
N$16  (1 unrouted)
  Top 0.254: R404.2 21.61,46.99 | IC401.1 27.96,36.83 20.34,36.83 20.34,44.45 21.61,44.45
  Top 0.406: 21.61,44.45 R404.2
N$17
  Top 0.254: R403.2 25.42,42.97 25.42,44.45 26.69,44.45 | 26.86,44.66 Q4.C
  Top 0.406: 26.69,44.45 R402.1 26.86,44.66
N$18
  Top 0.254: 29.23,46.67 R401.1
  Top 0.406: Q4.B 29.23,46.67
N$19
  Bottom 1.27: J4.2 48.28,6.35 41.93,12.7 41.93,13.97 39.39,15.24 32.41,22.86 32.41,27.3 25.42,33.02 IC401.2
N$20
  Top 0.406: R205.1 24.36,15.03 24.15,14.61 R206.2
  Bottom 1.016: J2.1 30.5,6.35 R206.2
N$21  (1 unrouted)
  Top 0.254: U$9.1 91.21,24.52 91.46,24.77 91.46,25.4
N$22  (1 unrouted)
  Top 0.254: U$9.3 93.61,24.2 93.36,24.45 93.05,24.45 92.73,24.77 92.73,25.4
N$23  (2 unrouted)
  Top 0.254: 90.19,25.4 C3.1 90.83,19.05 92.09,17.78 R2.2 | K1.1 100.98,13.97 100.98,17.78 100.35,18.41 94,18.41 92.73,17.78
N$25
  Top 0.254: IC2.4 94,24.77 94.32,24.45 94.32,20.64 R2.1
N$26
  Top 0.254: K1.3 89.87,15.24 88.6,16.51 88.6,30.16 89.87,31.43 90.83,31.43 92.73,33.34 IC2.18
N$27  (1 unrouted)
  Top 0.254: K1.2 95.57,14.59 94.95,14.61 89.55,14.61 87.97,16.19 87.97,30.48 89.55,32.07 90.51,32.07 91.46,33.02 91.46,35.56
N$28
  Top 0.254: LED1.A 95.91,24.13 95.27,24.77 IC2.5
N$29  (1 unrouted)
  Top 0.254: C2.1 92.33,37.23 arc90 92.73,36.83 94,36.83 94,35.56
N$30
  Top 0.254: LED2.A 97.81,24.13 96.54,24.77 IC2.6
N$31
  Top 0.254: LED1.C 95.91,20.95 95.27,20.32 R3.1
N$32
  Top 0.254: LED2.C R4.1
N$33
  Top 0.254: R504.1 39.39,26.45 39.39,27.94 40.66,27.94 | R503.1 C501.1
  Top 0.406: 40.66,27.94 R503.1 40.66,28.57
N$34
  Top 0.254: C502.1 R504.2 36.85,28.16 36.85,20.32 44.47,20.32 IC3.1
N$35
  Top 0.254: R503.2 41.93,26.45 41.93,27.94 43.2,27.94 | 43.37,28.16 Q5.C
  Top 0.406: 43.2,27.94 R502.1 43.37,28.16
N$36
  Top 0.254: 45.57,28.16 Q5.B
  Top 0.406: R501.1 45.57,28.16
N$37
  Top 0.254: C601.1 R603.1 39.39,44.66 39.39,43.18 38.12,43.18
  Top 0.406: 38.12,43.18 R604.1
N$38
  Top 0.254: C602.1 R604.2 36.85,44.66 36.85,36.83 44.47,36.83 IC4.1
N$39
  Top 0.254: 43.2,47.62 R602.1 41.93,44.66 41.93,43.18 40.66,43.18
  Top 0.406: Q6.C 43.2,47.62 | 40.66,43.18 R603.2
N$40  (1 unrouted)
  Top 0.254: R601.1 45.74,46.99
N$41
  Bottom 1.27: J7.2 78.76,6.35 74.95,10.16 74.95,13.97 71.14,17.78 68.6,17.78 67.33,19.05 59.71,19.05 58.44,20.32 IC5.2
N$42
  Top 0.254: 54.63,26.67 55.9,26.67 55.9,28.16 R703.1 C701.1
  Top 0.406: 54.63,26.67 R704.1
N$43
  Top 0.254: C702.1 R704.2 53.36,28.16 53.36,20.32 60.98,20.32 IC5.1
N$44
  Top 0.254: 59.88,28.16 Q7.C | R702.1 58.44,28.16 58.44,26.67 57.17,26.67
  Top 0.406: R702.1 59.88,28.16 | 57.17,26.67 R703.2
N$45
  Top 0.254: 62.25,30.16 R701.1
  Top 0.406: Q7.B 62.25,30.16
N$46
  Top 0.254: C801.1 R803.1 55.9,44.66 55.9,42.97 R804.1
N$47
  Top 0.254: C802.1 R804.2 53.36,44.66 53.36,37.47 60.98,37.47 IC6.1
N$48
  Top 0.254: 59.88,47.16 59.71,46.99 R802.1 58.44,44.66 58.44,42.97 R803.2
  Top 0.406: Q8.C 59.88,47.16
N$49
  Top 0.254: Q8.B 62.08,45.89 62.25,45.72 R801.1
N$50
  Bottom 1.27: J8.2 88.92,11.43 87.65,12.7 83.84,12.7 62.25,34.29 60.98,34.29 58.44,36.83 IC6.2
N$51  (1 unrouted)
  Top 0.406: R305.1 33.26,14.39 R306.2
  Bottom 1.27: J3.1 40.66,6.35 36.85,10.16 34.95,10.16 33.04,12.06
N$52
  Top 0.406: R605.1 67.55,12.48 R606.2
  Bottom 1.27: J6.1 71.14,6.35 67.33,10.16 R606.2
N$53
  Top 0.254: R705.1 77.7,12.48 R706.2
  Bottom 1.27: J7.1 81.3,6.35 77.49,10.16 R706.2
N$54
  Top 0.254: 91.46,10.79 92.31,11.64 R805.1
  Top 0.406: R806.2 91.46,10.79
  Bottom 1.27: J8.1 R806.2
N$55
  Top 0.406: R505.1 57.39,14.39 R506.2
  Bottom 1.27: J5.1 60.98,6.35 57.17,10.16 R506.2
PWM0  (via drill 0.6)
  Top 0.254: IC1.14 86.38,53.98 v86.06,52.39 | v66.38,50.48 69.87,49.53 69.87,48.26 70.5,47.31 70.5,40.32 65.11,34.92 22.25,34.92 13.78,26.45 R101.2
  Bottom 0.254: v86.06,52.39 85.11,52.07 74.31,52.07 67.33,50.48 v66.38,50.48
PWM1  (via drill 0.6)
  Top 0.254: R201.2 13.14,35.56 64.79,35.56 69.87,40.64 69.87,46.99 v68.92,48.58 | IC1.6 v85.11,47.62
  Bottom 0.254: v85.11,47.62 83.2,49.53 74.95,49.53 72.41,48.26 71.77,48.26 71.14,48.9 v68.92,48.58
PWM2  (via drill 0.6)
  Top 0.254: IC1.15 v85.11,53.98 | v67.33,51.44 70.5,50.8 70.5,48.58 71.14,47.62 71.14,40.01 65.42,34.29 38.12,34.29 30.29,26.45 R301.2
  Bottom 0.254: v85.11,53.98 83.84,52.7 74.31,52.7 68.28,51.44 v67.33,51.44
PWM3  (via drill 0.6)
  Top 0.254: R401.2 29.65,36.2 64.47,36.2 69.23,40.96 69.23,46.67 67.96,47.94 v66.69,48.58 | IC1.8 87.65,47.62 v85.74,49.53
  Bottom 0.254: v85.74,49.53 84.47,50.8 74.31,50.8 67.96,49.21 v66.69,48.58
PWM4  (via drill 0.6)
  Top 0.203: R501.2 45.74,26.67
  Top 0.254: IC1.16 v83.84,53.98 | v68.28,52.39 71.14,51.44 71.14,48.9 71.77,47.94 71.77,39.69 65.74,33.66 54,33.66 47.01,26.67 45.74,26.67
  Bottom 0.254: v83.84,53.98 83.2,53.34 73.68,53.34 v68.28,52.39
PWM5  (via drill 0.6)
  Top 0.254: R601.2 45.74,41.91 46.38,36.83 64.16,36.83 68.6,41.27 68.6,46.35 67.33,47.62 66.06,47.62 65.42,48.26 v65.42,49.53 | IC1.9 v88.92,48.9
  Bottom 0.254: v88.92,48.9 85.11,51.44 74.31,51.44 66.38,49.53 v65.42,49.53
PWM6  (via drill 0.6)
  Top 0.254: R701.2 63.3,26.45 63.52,26.67 63.52,30.48 72.41,39.37 72.41,47.62 v72.09,49.21 | IC1.7 v86.38,47.62
  Bottom 0.254: v86.38,47.62 83.84,50.16 74.31,50.16 v72.09,49.21
PWM7  (via drill 0.6)
  Top 0.254: R801.2 64.79,43.18 v66.69,46.35 | IC1.5 83.84,46.99 v82.57,48.26
  Bottom 0.254: v82.57,48.26 82.57,48.9 75.58,48.9 73.05,47.62 v66.69,46.35
RXPIC  (via drill 0.6)  (1 unrouted)
  Top 0.254: 88.92,55.24 88.92,56.83 91.46,56.83 91.46,53.34 89.55,51.44 89.55,50.16 102.89,36.83 102.89,33.66 v101.62,32.38 | IC2.10 v101.62,28.57
  Bottom 0.254: v101.62,28.57 v101.62,32.38
SENS0
  Top 0.254: R105.2 13.14,17.57 15.26,19.68 65.42,19.68 67.33,21.59 67.33,29.84 70.82,33.34 70.82,35.88 74.31,39.37 78.76,39.37 80.66,37.47 IC10.15
  Top 0.406: R105.2 C103.1
SENS1
  Top 0.254: R205.2 22.66,18.84 22.88,19.05 65.74,19.05 67.96,21.27 67.96,29.53 71.46,33.02 71.46,35.56 74.63,38.73 IC10.1
  Top 0.406: R205.2 C203.1
SENS2
  Top 0.254: R305.2 31.55,18.2 31.77,18.41 66.06,18.41 68.6,20.95 68.6,29.21 72.09,32.7 72.09,35.24 74.95,38.1 78.76,38.1 80.66,36.2 IC10.14
  Top 0.406: C303.1 R305.2
SENS3
  Top 0.254: R405.2 42.99,17.57 43.2,17.78 66.38,17.78 69.23,20.64 69.23,28.89 72.73,32.38 72.73,34.92 75.27,37.47 IC10.2
  Top 0.406: C403.1 R405.2
SENS4
  Top 0.254: R505.2 55.69,16.93 55.9,17.14 66.69,17.14 69.87,20.32 69.87,28.57 73.36,32.07 73.36,34.61 74.31,35.56 80.66,35.56 81.3,34.92 IC10.13
  Top 0.406: C503.1 R505.2
SENS5  (1 unrouted)
  Top 0.254: R605.2 65.84,16.3 66.06,16.51 67.01,16.51 70.5,20 70.5,28.26 74,31.75 74,34.29 74.63,34.92 76.85,34.92
  Top 0.406: R605.2 C603.1
SENS6  (via drill 0.6)
  Top 0.254: C703.1 R705.2 76.22,13.97 76.22,15.24 78.76,15.24 79.39,14.61 v79.39,10.79 | v85.11,33.66 IC10.12
  Bottom 0.254: v85.11,33.66 85.11,21.59 87.02,19.68 87.02,15.88 88.92,13.97 92.73,12.06 94,9.53 94,2.54 84.47,2.54 82.57,7.62 v79.39,10.79
SENS7  (via drill 0.6)
  Top 0.254: R805.2 88.92,12.7 88.92,12.94 | v79.39,33.66 IC10.5 | v85.11,15.24 86.38,15.24 88.21,14.37 C803.1
  Top 0.406: 88.92,12.94 C803.1
  Bottom 0.254: v85.11,15.24 86.38,19.05 83.84,21.59 80.03,26.04 79.39,26.67 v79.39,33.66
SENSE  (via drill 0.6)
  Top 0.254: IC10.3 78.44,36.2 v78.76,36.51 | v76.22,47.62 76.22,50.16 80.03,53.98 IC1.19 80.03,56.83 79.39,57.47 62.89,57.47 61.93,56.52 SV3.4
  Bottom 0.254: v78.76,36.51 78.76,39.37 76.22,41.91 v76.22,47.62
TACH  (via drill 0.6)  (1 unrouted)
  Top 0.203: R5.1 84.47,46.99
  Top 0.254: IC11.3 78.12,24.77 v79.08,24.13 | 84.47,46.99 83.84,47.94 83.84,52.07 82.57,53.98 82.57,55.88 | v85.74,40.96 85.74,44.13 R5.1
  Bottom 0.254: v79.08,24.13 78.76,24.13 78.76,32.38 78.12,33.02 78.12,34.29 80.03,36.2 79.71,39.05 77.49,41.91 77.49,45.09 85.74,45.09 v85.74,40.96
TACH0  (1 unrouted)
  Top 0.254: J9.3 15.26,7.62 18.43,10.79 68.6,10.79 68.6,16.83 71.14,19.05 71.14,27.94 78.76,27.94 80.66,26.04 83.2,26.04
TACH1  (1 unrouted)
  Top 0.254: 25.42,6.35 29.23,10.16 69.23,10.16 69.23,16.51 71.77,18.73 71.77,27.3 76.85,27.3
  Top 0.406: J2.3 25.42,6.35
TACH2  (1 unrouted)
  Top 0.254: 35.58,6.35 38.76,9.53 69.87,9.53 69.87,16.19 72.41,18.41 72.41,26.67 79.08,26.67 80.98,24.77 83.2,24.77
  Top 0.406: J3.3 35.58,6.35
TACH3
  Top 0.254: 45.74,6.35 48.28,8.89 70.5,8.89 70.5,15.88 73.05,18.1 73.05,26.04 IC11.2
  Top 0.406: J4.3 45.74,6.35
TACH4  (1 unrouted)
  Top 0.254: 55.9,6.35 57.8,8.26 78.76,8.26 79.39,8.26 81.3,10.16 81.3,15.88 73.68,15.88 73.68,25.4 79.39,25.4 81.3,23.5 83.2,23.5
  Top 0.406: J5.3 55.9,6.35
TACH5
  Top 0.254: 66.06,6.35 67.33,7.62 78.76,7.62 80.03,7.62 81.94,9.53 81.94,16.51 74.31,16.51 74.31,23.5 IC11.4
  Top 0.406: J6.3 66.06,6.35
TACH6  (1 unrouted)
  Top 0.254: J7.3 76.22,6.99 80.66,6.99 82.57,8.89 82.57,17.14 74.95,17.14 74.95,22.86 80.03,22.86 80.66,22.23 83.2,22.23
TACH7
  Top 0.254: J8.3 83.2,8.89 83.2,17.78 75.58,17.78 75.58,22.23 IC11.5
TXPIC
  Top 0.254: IC2.12 100.35,38.42 92.73,46.04 IC1.10

### Text on the board
tPlace: PCCASEFANCTRLx8 | REV 1.0 | by bwack